# EAGLE design DCF77_transmitter2 (EAGLE 8.3.2)
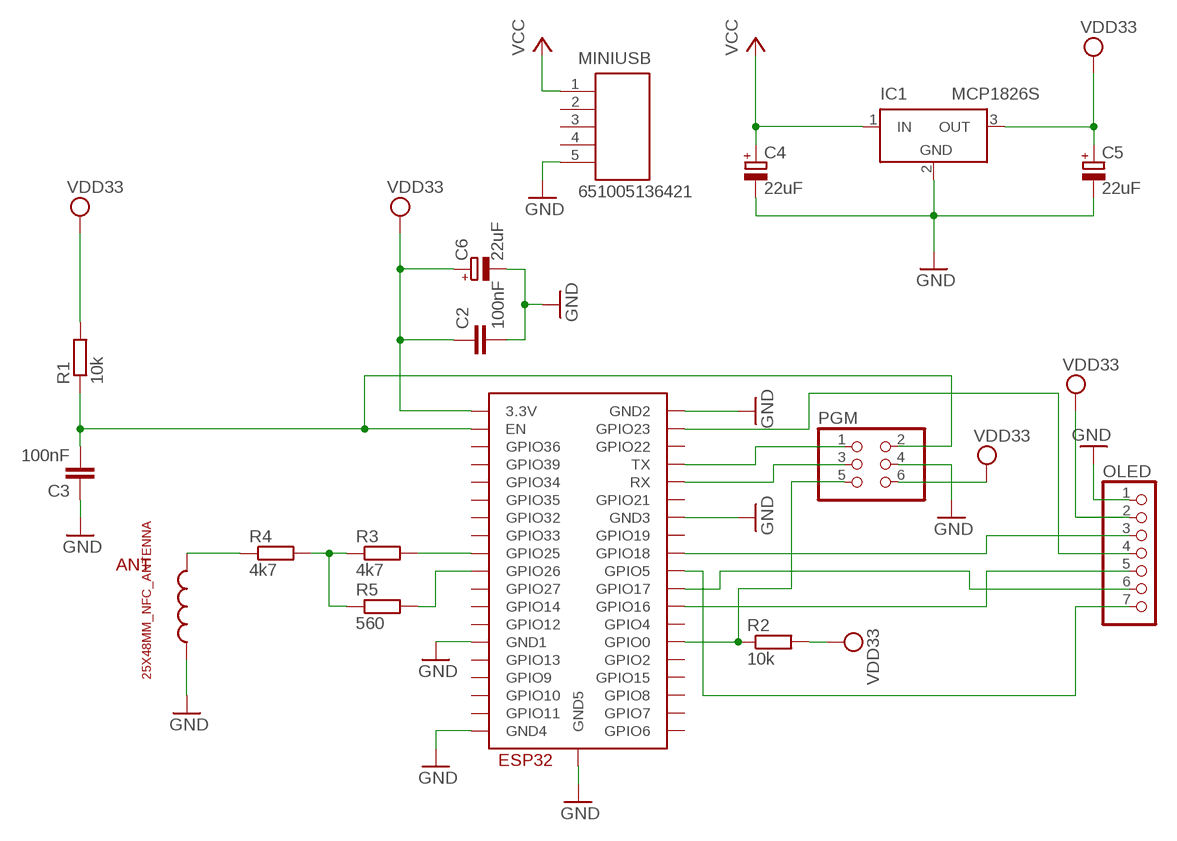
[diagram p0: schematic, sheet 1]

## Parts
ANT  25X48MM_NFC_ANTENNA  [25X48MM_NFC_ANTENNA]
C2  100nF  C-EUC1206  [C1206]
C3  100nF  C-EUC1206  [C1206]
C4  22uF  CPOL-EUB/3528-21W  [B/3528-21W]
C5  22uF  CPOL-EUB/3528-21W  [B/3528-21W]
C6  22uF  CPOL-EUB/3528-21W  [B/3528-21W]
IC1  MCP1826S  LT1129CST5  [SOT223]
MINIUSB  651005136421  [651005136421]
OLED  PINHD-1X7  [1X07]
PGM  PINHD-2X3  [2X03]
R1  10k  R-EU_R1206  [R1206]
R2  10k  R-EU_R1206  [R1206]
R3  4k7  R-EU_R1206  [R1206]
R4  4k7  R-EU_R1206  [R1206]
R5  560  R-EU_R1206  [R1206]
U$2  ESP32-WROOM  [ESP32-WROOM]

## Nets
EN: C3.2 PGM.2 R1.1 U$2.EN
GND: ANT.P$2 C2.2 C3.1 C4.- C5.- C6.- IC1.2(GND) MINIUSB.5 OLED.1 PGM.4 U$2.GND1 U$2.GND2 U$2.GND3 U$2.GND4 U$2.GND5
GPIO0: PGM.5 R2.1 U$2.IO0(GPIO0)
GPIO5: OLED.7 U$2.IO5(GPIO5)
GPIO16: OLED.5 U$2.IO16(GPIO16)
GPIO17: OLED.6 U$2.IO17(GPIO17)
GPIO18: OLED.3 U$2.IO18(GPIO18)
GPIO23: OLED.4 U$2.IO23(GPIO23)
N$1: R5.2 U$2.IO26(GPIO26)
N$2: R3.2 U$2.IO25(GPIO25)
N$3: R3.1 R4.2 R5.1
N$4: ANT.P$1 R4.1
RX: PGM.3 U$2.RX
TX: PGM.1 U$2.TX
VCC: C4.+ IC1.1(IN) MINIUSB.1
VDD33: C2.1 C5.+ C6.+ IC1.3(OUT) OLED.2 PGM.6 R1.2 R2.2 U$2.3V3(3.3V)
Unconnected: MINIUSB.2 MINIUSB.3 MINIUSB.4 U$2.CLK(GPIO6) U$2.CMD(GPIO11) U$2.IO2(GPIO2) U$2.IO4(GPIO4) U$2.IO12(GPIO12) U$2.IO13(GPIO13) U$2.IO14(GPIO14) U$2.IO15(GPIO15) U$2.IO19(GPIO19) U$2.IO21(GPIO21) U$2.IO22(GPIO22) U$2.IO27(GPIO27) U$2.IO32(GPIO32) U$2.IO33(GPIO33) U$2.IO34(GPIO34) U$2.IO35(GPIO35) U$2.SD0(GPIO7) U$2.SD1(GPIO8) U$2.SD2(GPIO9) U$2.SD3(GPIO10) U$2.SENSOR_VN(GPIO39) U$2.SENSOR_VP(GPIO36)

## Power pins joined to a net without a drawn wire
GND: IC1.4(GND)

## Library data of the parts
ANT = RFID_antenna_my:25X48MM_NFC_ANTENNA: 25x48 mm NFC loop antenna, L = 2,75 µH
C2 C3 = rcl:C-EU: CAPACITOR, European symbol
C4-C6 = rcl:CPOL-EU: POLARIZED CAPACITOR, European symbol
IC1 = linear-technology:LT1129CST5: VOLTAGE REGULATOR with shutdown; MPN: LT1129CST-5#PBF; OC_FARNELL: 1663375; OC_NEWARK: 57M2069
MINIUSB = Wuerth_Elektronik_eiCan_Communication_Connectors_STENCIL:651005136421: WR-COM Vertical 5 Contacts Mini USB Type B, 5 pins
OLED = pinhead:PINHD-1X7: PIN HEADER
PGM = pinhead:PINHD-2X3: PIN HEADER
R1-R5 = resistor:R-EU_: RESISTOR, European symbol
U$2 = ESP32-other:ESP32-WROOM

## Board
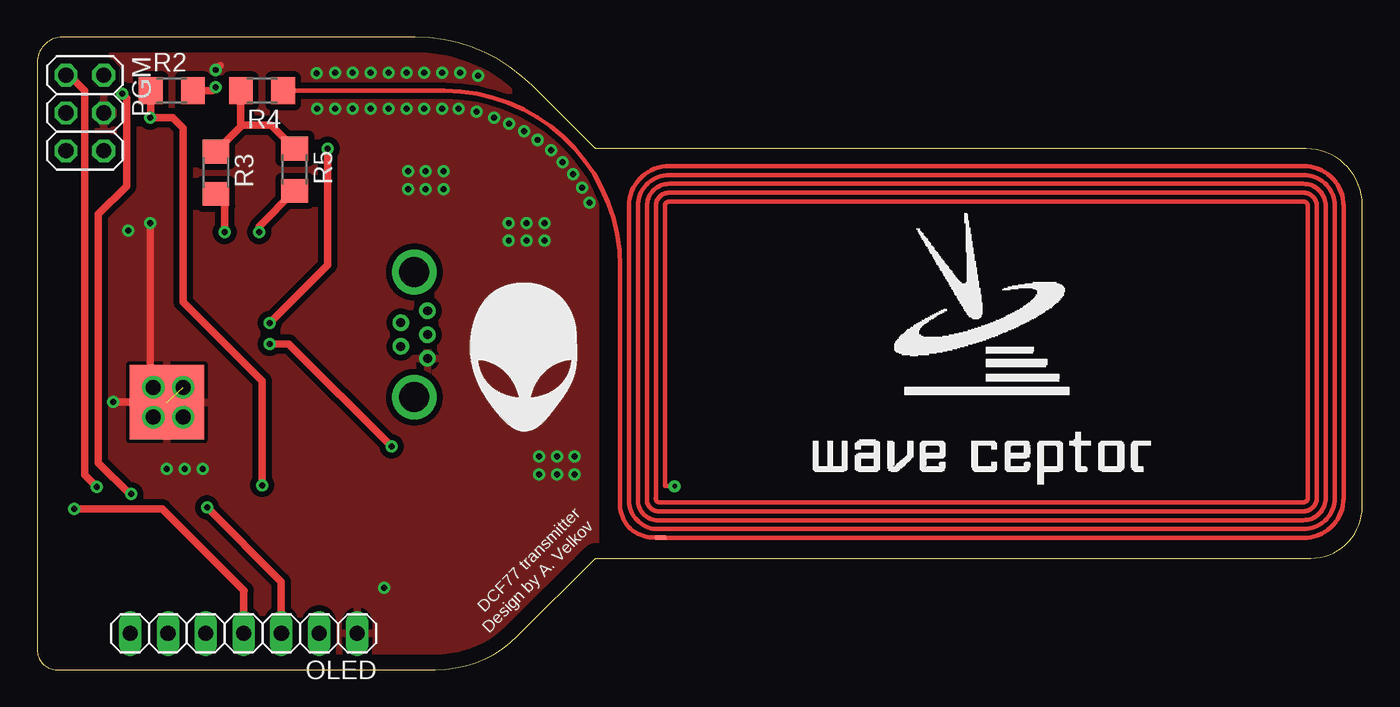
[diagram p1: board, top side]
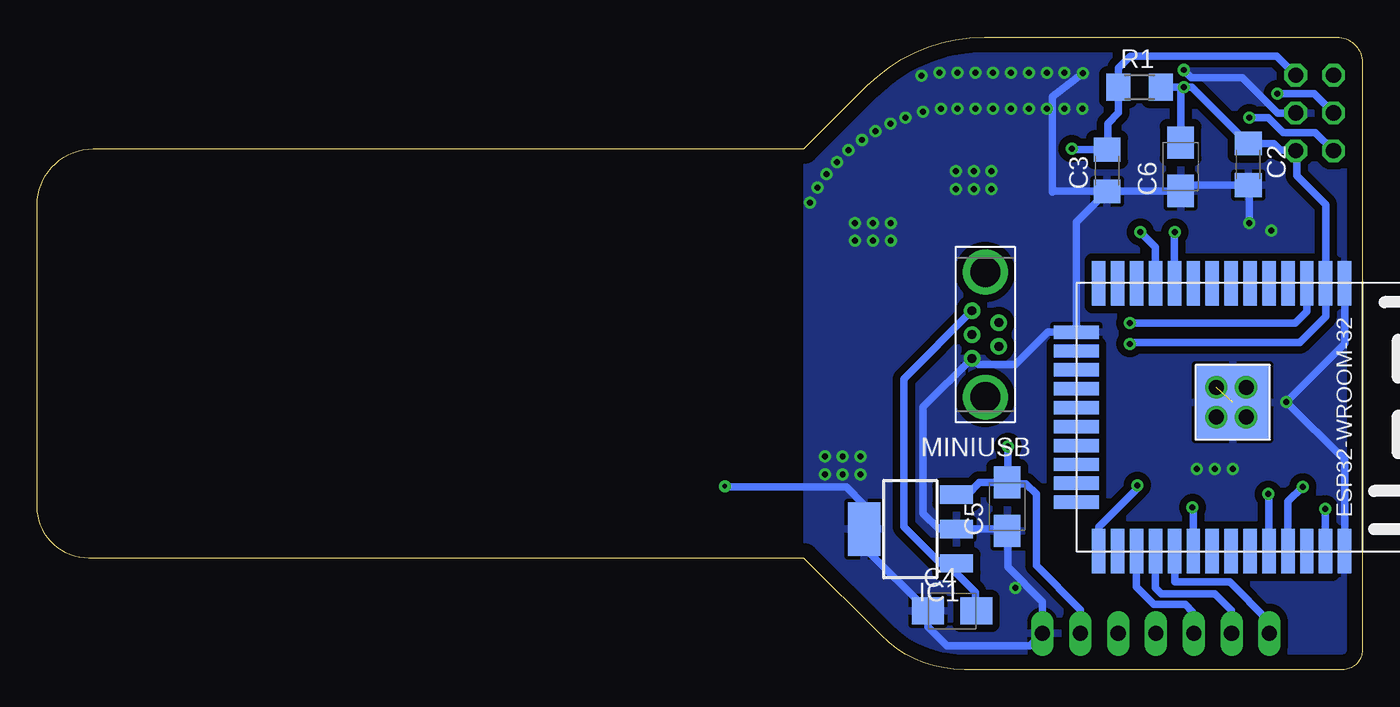
[diagram p2: board, bottom side, seen from below]

Size 89 x 42.5 mm. Coordinates in mm from the lower left corner, seen from the top.
Outline: 0,40.79 0,1.32 arc90 1.32,0 26.74,0 arc45 32.31,2.31 37.5,7.5 85.54,7.5 arc90 89,10.96 89,31.24 arc90 85.24,35 37.5,35 33.26,39.24 arc45 25.39,42.5 1.71,42.5 arc90 0,40.79
Copper layers (1*16): Top 0.035mm / dielectric 1.5mm / Bottom 0.035mm
Design rules "default *": minimum track width 6mil, minimum drill 0.35mm, track to track 6mil, track to pad 6mil, pad to pad 6mil, via to via 6mil, smd to smd 6mil, copper to edge 40mil, drill to drill 6mil, minimum pad ring 10mil, minimum via ring 8mil, stop-mask expansion 2mil, vias tented up to drill 16mil, thermal gap 10mil

### Footprints (pad centres in the part's own frame; a part is rotated, then mirrored left to right if it is on the bottom)
25X48MM_NFC_ANTENNA = smd 0.75 x 0.3: P$1 21.895,12.475 | drill 0.3: P$2 20.935,9.025
C1206 = smd 1.6 x 1.8: 1 -1.4,0; 2 1.4,0
B/3528-21W = smd 2.15 x 1.8: + 1.625,0; - -1.625,0
SOT223 = smd 1.219 x 2.235: 1 -2.311,-3.099; 2 0,-3.099; 3 2.311,-3.099 | smd 3.6 x 2.2: 4 0,3.099
651005136421 = drill 0.6: 1 0.9,-1.6; 2 -0.9,-0.8; 3 0.9,0; 4 -0.9,0.8; 5 0.9,1.6 | drill 2: Z1 0,4.2; Z2 0,-4.2
1X07 = drill 1.016 long: 1 -7.62,0; 2 -5.08,0; 3 -2.54,0; 4 0,0; 5 2.54,0; 6 5.08,0; 7 7.62,0
2X03 = drill 1.016 octagon: 1 -2.54,-1.27; 2 -2.54,1.27; 3 0,-1.27; 4 0,1.27; 5 2.54,-1.27; 6 2.54,1.27
R1206 = smd 1.6 x 1.803: 1 -1.422,0; 2 1.422,0
ESP32-WROOM = smd 3 x 0.9: 3V3 0,16.74; EN 0,15.47; GND1 0,18.01; GND3 18,18.01; IO0 18,1.5; IO4 18,2.77; IO5 18,6.58; IO12 0,1.5; IO14 0,2.77; IO16 18,4.04; IO17 18,5.31; IO18 18,7.85; IO19 18,9.12; IO21 18,11.66; IO22 18,15.47; IO23 18,16.74; IO25 0,6.58; IO26 0,5.31; IO27 0,4.04; IO32 0,9.12; IO33 0,7.85; IO34 0,11.66; IO35 0,10.39; NC 18,10.39; RX 18,12.93; SENSOR_VN 0,12.93; SENSOR_VP 0,14.2; TX 18,14.2 | smd 0.9 x 3: CLK 9.635,0; CMD 8.365,0; GND2 3.285,0; IO2 14.715,0; IO13 4.555,0; IO15 13.445,0; SD0 10.905,0; SD1 12.175,0; SD2 5.825,0; SD3 7.095,0 | smd 5 x 5: GND4 8,10.5 | smd 5 x 5 bottom: GND5 8,10.5

### Placement (x,y rotation side)
ANT  63.75,21.35 180 top
C2  7.66,33.96 270 bottom
C3  17.14,33.54 90 bottom
C4  27.55,3.95 0 bottom
C5  23.85,10.95 90 bottom
C6  12.2,33.8 90 bottom
IC1  30.36,9.45 90 bottom
MINIUSB  25.32,22.52 180 bottom
OLED  13.86,2.44 180 top
PGM  3.2,37.41 270 top
R1  14.96,39.14 0 bottom
R2  9.04,38.9 0 top
R3  12,33.4 270 top
R4  15.1,38.9 180 top
R5  17.3,33.6 270 top
U$2  19.2,25.97 270 bottom

### Tracks (layer width: path | path; a pad name or v marks a point on that pad's centre or on a via)
EN  (via drill 0.4)
  Top 0.5: v15.6,23.3 19.5,27.2 v19.5,35
  Bottom 0.5: U$2.EN 3.73,24.07 4.5,23.3 v15.6,23.3 | v19.5,35 19.44,34.94 C3.2 17.1,34.98 17.1,36.7 16.38,37.42 R1.1 16.38,40.42 15.57,41.23 5.75,41.23 PGM.2
GND  (via drill 0.4, 1)  (1 unrouted)
  Top 0.5: 7.8,18 v5.1,18 | 7.8,18 8.67,18 U$2.GND5 | v12,40.3 12.3,40.6 | v7.6,30 7.6,19.3 7.8,19.1 v7.8,18.98 7.8,18
  Bottom 0.5: 17.11,32.18 C6.- 11.81,32.56 C2.2 7.6,32.5 v7.6,30 | 17.11,32.18 C3.1 19.2,30.08 U$2.GND2 21.11,22.69 23.3,20.5 25.8,20.5 MINIUSB.5 29.5,17.64 29.5,10.5 28.45,9.45 IC1.2 23.98,9.45 C5.- 23.8,9.28 23.8,6.9 21.48,4.58 OLED.1 22.32,1.6 27.9,1.6 29.18,2.88 C4.- 33.46,8.23 IC1.4 33.46,11.08 34.65,12.28 42.77,12.28 ANT.P$2 | U$2.GND3 1.19,14.09 v5.1,18 1.19,21.91 U$2.GND1 | PGM.4 5.69,37.41 8.07,39.79 11.49,39.79 v12,40.3 | v18.77,40.08 20.8,38.5 20.8,32.1 20.73,32.18 17.11,32.18
  other vias: 20,40.1 21.2,40.1 22.4,40.1 23.6,40.1 24.8,40.1 26,40.1 27.2,40.1 28.4,40.1 29.6,39.9 18.8,37.7 20,37.7 21.2,37.7 22.4,37.7 23.6,37.7 24.8,37.7 26,37.7 27.2,37.7 28.3,37.7 29.5,37.5 30.7,37.1 31.7,36.7 32.7,36.2 33.6,35.6 34.5,34.9 35.3,34.1 36,33.3 36.6,32.4 37.1,31.4 8.7,13.5 9.9,13.5 11.1,13.5 23.3,5.5 6.1,29.5 24.9,33.5 26.1,33.5 27.3,33.5 24.9,32.3 26.1,32.3 27.3,32.3 31.68,30.03 32.88,30.03 34.08,30.03 31.68,28.83 32.88,28.83 34.08,28.83 33.7,14.32 34.9,14.32 36.1,14.32 33.7,13.12 34.9,13.12 36.1,13.12 9.8,18.98 7.8,16.98 9.8,16.98
  pour Bottom (isolate 0.5): -1.2,45.3 37.3,45.3 37.3,-5 -5.8,-5 -5.8,46.1 -1.2,46.1
  pour Top (isolate 0.4): -4,49 37.5,49 37.5,-2.5 -4,-3
GPIO0  (via drill 0.4)
  Top 0.5: R2.1 7.62,37.12 v7.6,37.1 9.1,37.1 9.8,36.4 9.8,24.7 15.1,19.4 v15.1,12.4
  Bottom 0.5: PGM.5 3.16,36.1 5.3,36.1 6.3,37.1 v7.6,37.1 | U$2.IO0 17.7,9.6 15.1,12.2 v15.1,12.4
GPIO5
  Bottom 0.5: U$2.IO5 12.6,7.95 12.6,5.9 8.9,5.9 6.3,3.3 6.3,2.5 OLED.7
GPIO16
  Bottom 0.5: U$2.IO16 15.16,5.56 14,4.4 11.9,4.4 11.4,3.9 11.4,2.52 OLED.5
GPIO17
  Bottom 0.5: U$2.IO17 13.89,5.49 13.5,5.1 9.9,5.1 8.8,4 8.8,2.46 OLED.6
GPIO18  (via drill 0.4)
  Top 0.5: v11.4,10.9 16.4,5.9 OLED.3
  Bottom 0.5: U$2.IO18 11.35,10.85 v11.4,10.9
GPIO23  (via drill 0.4)
  Top 0.5: v2.5,10.8 8.4,10.8 13.9,5.3 13.86,5.3 OLED.4
  Bottom 0.5: U$2.IO23 2.5,8.01 v2.5,10.8
N$1  (via drill 0.4)
  Top 0.5: v14.9,29.4 14.9,29.78 R5.2
  Bottom 0.5: U$2.IO26 13.89,28.39 v14.9,29.4
N$2  (via drill 0.4)
  Top 0.5: v12.6,29.4 12.6,31.38 R3.2
  Bottom 0.5: U$2.IO25 12.62,29.38 v12.6,29.4
N$3
  Top 0.5: R3.1 13.68,36.5 13.68,36.6 | 13.68,36.6 R4.2 | R5.1 15.72,36.6 13.68,36.6
N$4
  Top 0.3: R4.1 27.38,38.9 arc-90 39.15,27.12 39.15,11.07 arc90 41.33,8.9 41.83,8.9 arc-90 ANT.P$1
RX  (via drill 0.4)
  Top 0.5: v5.7,38.7 6,38.4 6,32.5 4.1,30.6 4.1,13.9 6.2,11.8 v6.3,11.8
  Bottom 0.5: PGM.3 3.22,38.7 v5.7,38.7 | v6.3,11.8 6.27,11.77 U$2.RX
TX  (via drill 0.4)
  Top 0.5: v4,12.3 3.2,13.1 3.2,38.9 2.15,39.95 PGM.1
  Bottom 0.5: U$2.TX 5,11.3 v4,12.3
VCC
  Bottom 0.5: C4.+ 26,4.02 26,5.2 27.26,6.46 IC1.1 28.34,7.14 30.8,9.6 30.8,19.54 MINIUSB.1
VDD33  (via drill 0.4)
  Top 0.5: R2.2 11.76,38.9 v12,39.14 | v15.6,21.9 16.9,21.9 v23.8,15
  Bottom 0.5: OLED.2 18.94,4.04 21.9,7 21.9,11.8 22.6,12.5 23.77,12.5 C5.+ 23.88,12.6 24,12.6 | IC1.3 26.54,11.76 25.7,12.6 24,12.6 | 12.2,39.14 R1.2 | 12.2,39.14 v12,39.14 11.44,39.14 C2.1 5.96,35.36 5.5,34.9 4.5,34.9 PGM.6 4.4,34.8 4.4,33.2 2.46,31.26 U$2.3V3 2.46,23.74 4.2,22 15.5,22 v15.6,21.9 | 12.2,39.14 C6.+ | v23.8,15 23.8,12.8 24,12.6

### Text on the board
tPlace: DCF77 transmitter / Design by A. Velkov